# Altium schematic sheet 上层控制板.SchDoc
size A3; SheetNumber: 1; SheetTotal: 3
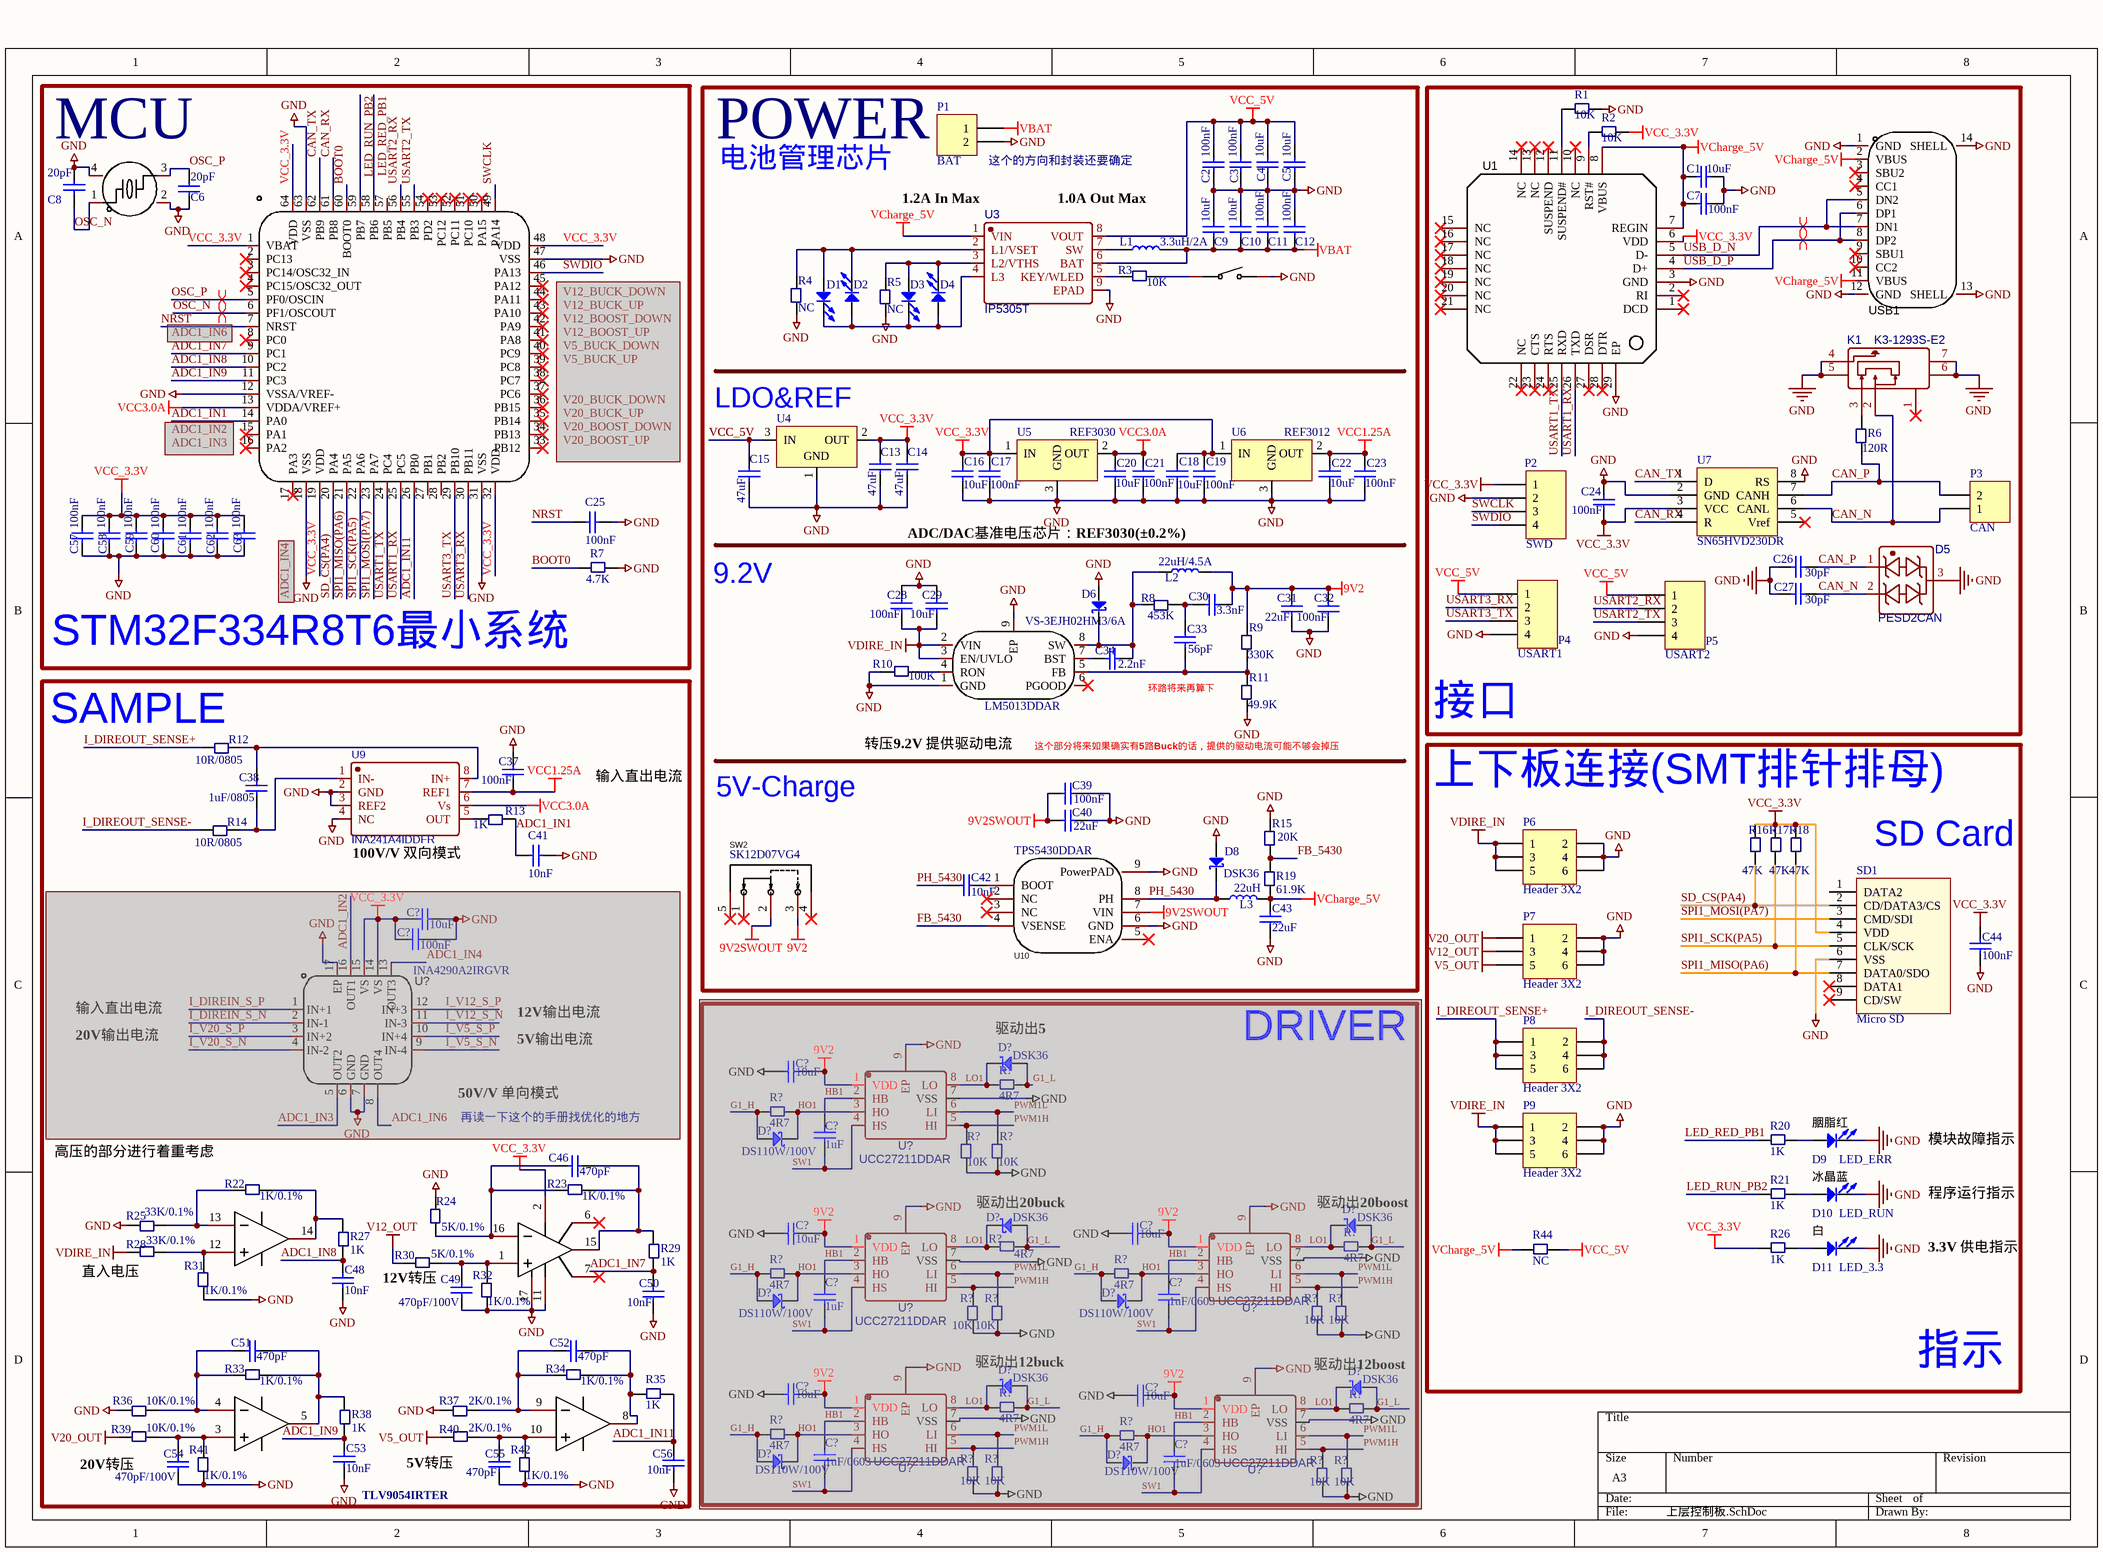
[diagram p0: 上层控制板.SchDoc]

## Parts
(Parts that share a designator on the sheet are numbered #1, #2 ... from top to bottom, then left to right.)
C1  10uF  [C 0603_M]
C2  100nF  [C 0603_M]
C3  100nF  [C 0603_M]
C4  10uF  [C 0603_M]
C5  10uF  [C 0603_M]
C6  20pF  [C 0603_M]
C7  100nF  [C 0603_M]
C8  20pF  [C 0603_M]
C9  10uF  [C 0603_M]
C10  10uF  [C 0603_M]
C11  100nF  [C 0603_M]
C12  100nF  [C 0603_M]
C13  47uF  [CAP-SMD_L3.2-W1.6]
C14  47uF  [CAP-SMD_L3.2-W1.6]
C15  47uF  [CAP-SMD_L3.2-W1.6]
C16  10uF  [C 0603_M]
C17  100nF  [C 0603_M]
C18  10uF  [C 0603_M]
C19  100nF  [C 0603_M]
C20  10uF  [C 0603_M]
C21  100nF  [C 0603_M]
C22  10uF  [C 0603_M]
C23  100nF  [C 0603_M]
C24  100nF  [C 0603_M]
C25  100nF  [C 0603_M]
C26  30pF  [C 0603_M]
C27  30pF  [C 0603_M]
C28  100nF  [C 0805]
C29  10uF  [C 0805]
C30  3.3nF  [C 0805]
C31  22uF  [C 0603_M]
C32  100nF  [C 0603_M]
C33  56pF  [C 0805]
C34  2.2nF  [C 0603_M]
C37  100nF  [C 0603_M]
C38  1uF/0805  [C 0805]
C39  100nF  [C 0603_M]
C40  22uF  [C 0603_M]
C41  10nF  [C 0603_M]
C42  10nF  [C 0603_M]
C43  22uF  [C 0603_M]
C44  100nF  [C 0603_M]
C46  470pF  [C 0603_M]
C48  10nF  [C 0603_M]
C49  470pF/100V  [C 0603_M]
C50  10nF  [C 0603_M]
C51  470pF  [C 0603_M]
C52  470pF  [C 0603_M]
C53  10nF  [C 0603_M]
C54  470pF/100V  [C 0603_M]
C55  470pF  [C 0603_M]
C56  10nF  [C 0603_M]
C57  100nF  [C 0603_M]
C58  100nF  [C 0603_M]
C59  100nF  [C 0603_M]
C60  100nF  [C 0603_M]
C61  100nF  [C 0603_M]
C62  100nF  [C 0603_M]
C63  100nF  [C 0603_M]
C?#1  10uF  [C_0603]  (masked out: inside a compile mask, not in the netlist)
C?#2  100nF  [C_0603]  (masked out: inside a compile mask, not in the netlist)
C?#3  10uF  [C 0603_M]  (masked out: inside a compile mask, not in the netlist)
C?#4  1uF  [C 0603_M]  (masked out: inside a compile mask, not in the netlist)
C?#5  10uF  [C 0603_M]  (masked out: inside a compile mask, not in the netlist)
C?#6  10uF  [C 0603_M]  (masked out: inside a compile mask, not in the netlist)
C?#7  1uF  [C 0603_M]  (masked out: inside a compile mask, not in the netlist)
C?#8  1uF/0603  [C 0603_M]  (masked out: inside a compile mask, not in the netlist)
C?#9  10uF  [C 0603_M]  (masked out: inside a compile mask, not in the netlist)
C?#10  10uF  [C 0603_M]  (masked out: inside a compile mask, not in the netlist)
C?#11  1uF/0603  [C 0603_M]  (masked out: inside a compile mask, not in the netlist)
C?#12  1uF/0603  [C 0603_M]  (masked out: inside a compile mask, not in the netlist)
D1  LED  [LED-0603W]  (value not drawn)
D2  LED  [LED-0603W]  (value not drawn)
D3  LED  [LED-0603W]  (value not drawn)
D4  LED  [LED-0603W]  (value not drawn)
D5  PESD2CAN  [SOT-23-3_L2.9-W1.3-P1.90-LS2.4-BR]
D6  VS-3EJH02HM3/6A  [DO-221AC_L4.4-W2.6-LS5.2-RD]
D8  DSK36  [SOD-123FL_L2.8-W1.8-LS3.7-R-RD]
D9  LED_ERR  [LED-0603W]
D10  LED_RUN  [LED-0603W]
D11  LED_3.3  [LED-0603W]
D?#1  DSK36  [SOD-123FL_L2.7-W1.8-LS3.8-RD]  (masked out: inside a compile mask, not in the netlist)
D?#2  DS110W/100V  [SOD-123FL_L2.7-W1.8-LS3.8-RD]  (masked out: inside a compile mask, not in the netlist)
D?#3  DSK36  [SOD-123FL_L2.7-W1.8-LS3.8-RD]  (masked out: inside a compile mask, not in the netlist)
D?#4  DSK36  [SOD-123FL_L2.7-W1.8-LS3.8-RD]  (masked out: inside a compile mask, not in the netlist)
D?#5  DS110W/100V  [SOD-123FL_L2.7-W1.8-LS3.8-RD]  (masked out: inside a compile mask, not in the netlist)
D?#6  DS110W/100V  [SOD-123FL_L2.7-W1.8-LS3.8-RD]  (masked out: inside a compile mask, not in the netlist)
D?#7  DSK36  [SOD-123FL_L2.7-W1.8-LS3.8-RD]  (masked out: inside a compile mask, not in the netlist)
D?#8  DSK36  [SOD-123FL_L2.7-W1.8-LS3.8-RD]  (masked out: inside a compile mask, not in the netlist)
D?#9  DS110W/100V  [SOD-123FL_L2.7-W1.8-LS3.8-RD]  (masked out: inside a compile mask, not in the netlist)
D?#10  DS110W/100V  [SOD-123FL_L2.7-W1.8-LS3.8-RD]  (masked out: inside a compile mask, not in the netlist)
K1  K3-1293S-E2  [K3-1293S-E2]
L1  3.3uH/2A  [IND-SMD_L5.4-W5.2_FXL0530]
L2  22uH/4.5A  [IND-SMD_L7.1-W6.6]
L3  22uH  [IND-SMD_L7.2-W6.6_GPSR07X0]
P1  BAT  [BM02B-GHS-TBT]
P2  SWD  [BM04B-GHS-TBT]
P3  CAN  [BM02B-GHS-TBT]
P4  USART1  [BM04B-GHS-TBT]
P5  USART2  [BM04B-GHS-TBT]
P6  Header 3X2  [HDR-SMD_6P-P2.54-V-F-R2-C3-LS7.0]
P7  Header 3X2  [HDR-SMD_6P-P2.54-V-F-R2-C3-LS7.0]
P8  Header 3X2  [HDR-SMD_6P-P2.54-V-F-R2-C3-LS7.0]
P9  Header 3X2  [HDR-SMD_6P-P2.54-V-F-R2-C3-LS7.0]
R1  10K  [R0603_M]
R2  10K  [R0603_M]
R3  10K  [R0603_M]
R4  NC  [R0603_M]
R5  NC  [R0603_M]
R6  120R  [R0603_M]
R7  4.7K  [R0603_M]
R8  453K  [R0805]
R9  330K  [R0603_M]
R10  100K  [R0603_M]
R11  49.9K  [R0603_M]
R12  10R/0805  [R0805]
R13  1K  [R0603_M]
R14  10R/0805  [R0805]
R15  20K  [R0603_M]
R16  47K  [R0603_M]
R17  47K  [R0603_M]
R18  47K  [R0603_M]
R19  61.9K  [R0603_M]
R20  1K  [R0603_M]
R21  1K  [R0603_M]
R22  1K/0.1%  [R0805]
R23  1K/0.1%  [R0603_M]
R24  5K/0.1%  [R0603_M]
R25  33K/0.1%  [R0805]
R26  1K  [R0603_M]
R27  1K  [R0603_M]
R28  33K/0.1%  [R0805]
R29  1K  [R0603_M]
R30  5K/0.1%  [R0603_M]
R31  1K/0.1%  [R0805]
R32  1K/0.1%  [R0603_M]
R33  1K/0.1%  [R0603_M]
R34  1K/0.1%  [R0603_M]
R35  1K  [R0603_M]
R36  10K/0.1%  [R0603_M]
R37  2K/0.1%  [R0603_M]
R38  1K  [R0603_M]
R39  10K/0.1%  [R0603_M]
R40  2K/0.1%  [R0603_M]
R41  1K/0.1%  [R0603_M]
R42  1K/0.1%  [R0603_M]
R44  NC  [R1206_M]
R?#1  4R7  [R0603]  (masked out: inside a compile mask, not in the netlist)
R?#2  4R7  [R0603]  (masked out: inside a compile mask, not in the netlist)
R?#3  10K  [R0402]  (masked out: inside a compile mask, not in the netlist)
R?#4  10K  [R0402]  (masked out: inside a compile mask, not in the netlist)
R?#5  4R7  [R0603]  (masked out: inside a compile mask, not in the netlist)
R?#6  4R7  [R0603]  (masked out: inside a compile mask, not in the netlist)
R?#7  4R7  [R0603]  (masked out: inside a compile mask, not in the netlist)
R?#8  4R7  [R0603]  (masked out: inside a compile mask, not in the netlist)
R?#9  10K  [R0402]  (masked out: inside a compile mask, not in the netlist)
R?#10  10K  [R0402]  (masked out: inside a compile mask, not in the netlist)
R?#11  10K  [R0402]  (masked out: inside a compile mask, not in the netlist)
R?#12  10K  [R0402]  (masked out: inside a compile mask, not in the netlist)
R?#13  4R7  [R0603]  (masked out: inside a compile mask, not in the netlist)
R?#14  4R7  [R0603]  (masked out: inside a compile mask, not in the netlist)
R?#15  4R7  [R0603]  (masked out: inside a compile mask, not in the netlist)
R?#16  4R7  [R0603]  (masked out: inside a compile mask, not in the netlist)
R?#17  10K  [R0402]  (masked out: inside a compile mask, not in the netlist)
R?#18  10K  [R0402]  (masked out: inside a compile mask, not in the netlist)
R?#19  10K  [R0402]  (masked out: inside a compile mask, not in the netlist)
R?#20  10K  [R0402]  (masked out: inside a compile mask, not in the netlist)
SD1  Micro SD  [MICRO SD]
SW1  TS365TP  [KEY-SMD_L6.0-W3.5-LS8.4]  (value not drawn)
SW2  SK12D07VG4  [SW-TH_SK12D07VG4]
U1  CP2102-GMR  [WQFN-28_L5.0-W5.0-P0.50-BL-EP3.2]  (value not drawn)
U2  STM32F334R8T6  [LQFP-64_L10.0-W10.0-P0.50-LS12.0-BL]  (value not drawn)
U3  IP5305T  [ESOP-8_L4.9-W3.9-P1.27-LS6.0-BL-EP]
U4  LM1117-3.3  [SOT_223]  (value not drawn)
U5  REF3030  [SOT_23]
U6  REF3012  [SOT_23]
U7  SN65HVD230DR  [SOIC-8_L4.9-W3.9-P1.27-LS6.0-BL]
U8  LM5013DDAR  [ESOP-8_L4.9-W3.9-P1.27-LS6.0-BL-EP-1]
U9  INA241A4IDDFR  [SOT-23-8_L2.9-W1.6-P0.65-LS2.8-BL]
U10  TPS5430DDAR  [ESOP-8_L4.9-W3.9-P1.27-LS6.0-TL-EP]
U11  TLV9054IRTER  [WQFN-16_L3.0-W3.0-P0.50-TL-EP1.7]  (value not drawn)  (parts A,B,C,D of 4)
U?#1  INA4290A2IRGVR  [QFN-16_L4.0-W4.0-P0.65-TL-EP2.2]  (masked out: inside a compile mask, not in the netlist)
U?#2  UCC27211DDAR  [SOIC-8_L4.9-W3.9-P1.27-LS6.0-BL-EP]  (masked out: inside a compile mask, not in the netlist)
U?#3  UCC27211DDAR  [SOIC-8_L4.9-W3.9-P1.27-LS6.0-BL-EP]  (masked out: inside a compile mask, not in the netlist)
U?#4  UCC27211DDAR  [SOIC-8_L4.9-W3.9-P1.27-LS6.0-BL-EP]  (masked out: inside a compile mask, not in the netlist)
U?#5  UCC27211DDAR  [SOIC-8_L4.9-W3.9-P1.27-LS6.0-BL-EP]  (masked out: inside a compile mask, not in the netlist)
U?#6  UCC27211DDAR  [SOIC-8_L4.9-W3.9-P1.27-LS6.0-BL-EP]  (masked out: inside a compile mask, not in the netlist)
USB1  TYPE-C 16PIN 2MD(073)  [USB-C-SMD_TYPE-C-6PIN-2MD-073]  (value not drawn)
X1  X32258MOB4SI  [OSC-SMD_4P-L3.2-W2.5-BL]  (value not drawn)

## Blocks framed on the sheet
MCU: C6 C8 C25 C57-C63 R7 U2 X1
POWER: C2-C5 C9-C23 C28-C34 C39 C40 C42 C43 D1-D4 D6 D8 L1-L3 P1 R3-R5 R8-R11 R15 R19 SW1 SW2 U3-U6 U8 U10
接口: C1 C7 C24 C26 C27 D5 K1 P2-P5 R1 R2 R6 U1 U7 USB1
SAMPLE: C37 C38 C41 C46 C48-C56 C?#1 C?#2 R12-R14 R22-R25 R27-R42 U9 U11 U?#1
DRIVER: C?#3-C?#12 D?#1-D?#10 R?#1-R?#20 U?#2-U?#6

## Nets
9V2: C30.1 C31.1 C32.1 L2.2 R9.1 SW2.3
9V2SWOUT: C39.1 C40.1 SW2.2 U10.7(VIN)
GND: C1.1 C2.1 C3.1 C4.1 C5.1 C6.2 C7.1 C8.1 C9.2 C10.2 C11.2 C12.2 C13.1 C14.1 C15.1 C16.1 C17.1 C18.1 C19.1 C20.1 C21.1 C22.1 C23.1 C24.2 C25.1 C26.2 C27.2 C28.1 C29.1 C31.2 C32.2 C37.2 C39.2 C40.2 C41.1 C43.2 C44.1 C48.2 C49.1 C50.2 C53.2 C54.1 C55.1 C56.2 C57.1 C58.1 C59.1 C60.1 C61.1 C62.1 C63.1 D5.3 D6.1(A) D8.1(A) D9.2(K) D10.2(K) D11.2(K) K1.4 K1.5 K1.6 K1.7 P1.1(2) P2.2 P4.4 P5.4 P6.2 P6.4 P6.6 P7.2 P7.4 P7.6 P9.2 P9.4 P9.6 R1.1 R4.2 R5.2 R7.1 R10.2 R11.2 R15.1 R24.1 R25.1 R31.2 R32.2 R36.1 R37.1 R41.2 R42.2 SD1.6(VSS) SW1.2 U1.3(GND) U1.29(EP) U2.12(VSSA/VREF-) U2.18(VSS) U2.31(VSS) U2.47(VSS) U2.63(VSS) U3.9(EPAD) U4.1(GND) U5.3(GND) U6.3(GND) U7.2(GND) U7.8(RS) U8.1(GND) U8.9(EP) U9.2(GND) U9.3(REF2) U9.4(NC) U10.6(GND) U10.9(PowerPAD) U11.11(V-) U11.17(EP) USB1.1(GND) USB1.12(GND) USB1.13(SHELL) USB1.14(SHELL) X1.2(GND) X1.4(GND)
V5_OUT: P7.5 R40.2
V12_OUT: P7.3 R30.2
V20_OUT: P7.1 R39.2
VBAT: C9.1 C10.1 C11.1 C12.1 L1.2 P1.2(1) U3.6(BAT)
VCC1.25A: C22.2 C23.2 C37.1 U6.2(OUT) U9.7(REF1)
VCC3.0A: C20.2 C21.2 U2.13(VDDA/VREF+) U5.2(OUT) U9.6(Vs)
VCC_3.3V: C13.2 C14.2 C16.2 C17.2 C18.2 C19.2 C24.1 C44.2 C57.2 C58.2 C59.2 C60.2 C61.2 C62.2 C63.2 P2.1 R2.1 R16.2 R17.2 R18.2 R26.2 SD1.4(VDD) U1.6(VDD) U2.1(VBAT) U2.19(VDD) U2.32(VDD) U2.48(VDD) U2.64(VDD) U4.2(OUT) U5.1(IN) U6.1(IN) U7.3(VCC) U11.2(V+)
VCC_5V: C2.2 C3.2 C4.2 C5.2 C15.2 P4.1 P5.1 R44.1 U3.8(VOUT) U4.3(IN)
VCharge_5V: C1.2 C7.2 C43.1 L3.2 R19.2 R44.2 U1.7(REGIN) U1.8(VBUS) U3.1(VIN) USB1.2(VBUS) USB1.11(VBUS)
VDIRE_IN: C28.2 C29.2 P6.1 P6.3 P6.5 P9.1 P9.3 P9.5 R28.2 U8.2(VIN) U8.3(EN/UVLO)
ADC1_IN1: C41.2 R13.2 U2.14(PA0)
ADC1_IN7: C50.1 R29.1 U2.9(PC1)
ADC1_IN8: C48.1 R27.1 U2.10(PC2)
ADC1_IN9: C53.1 R38.1 U2.11(PC3)
ADC1_IN11: C56.1 R35.1 U2.26(PB0)
BOOT0: R7.2 U2.60(BOOT0)
CAN_N: C27.1 D5.2 K1.2 P3.2(1) U7.6(CANL)
CAN_P: C26.1 D5.1 P3.1(2) R6.2 U7.7(CANH)
CAN_RX: U2.61(PB8) U7.4(R)
CAN_TX: U2.62(PB9) U7.1(D)
FB_5430: R15.2 R19.1 U10.4(VSENSE)
I_DIREOUT_SENSE+: P8.1 P8.3 P8.5 R12.1
I_DIREOUT_SENSE-: P8.2 P8.4 P8.6 R14.1
LED_RED_PB1: R20.2 U2.58(PB6)
LED_RUN_PB2: R21.2 U2.59(PB7)
NRST: C25.2 U2.7(NRST)
OSC_N: C8.2 U2.6(PF1/OSCOUT) X1.1
OSC_P: C6.1 U2.5(PF0/OSCIN) X1.3
PH_5430: C42.2 D8.2(K) L3.1 U10.8(PH)
SD_CS(PA4): R16.1 SD1.2(CD/DATA3/CS) U2.20(PA4)
SPI1_MISO(PA6): R18.1 SD1.7(DATA0/SDO) U2.21(PA5)
SPI1_MOSI(PA7): SD1.3(CMD/SDI) U2.23(PA7)
SPI1_SCK(PA5): R17.1 SD1.5(CLK/SCK) U2.22(PA6)
SWCLK: P2.3 U2.49(PA14)
SWDIO: P2.4 U2.46(PA13)
USART1_RX: U1.26(TXD) U2.25(PC5)
USART1_TX: U1.25(RXD) U2.24(PC4)
USART2_RX: P5.2 U2.56(PB4)
USART2_TX: P5.3 U2.55(PB3)
USART3_RX: P4.2 U2.30(PB11)
USART3_TX: P4.3 U2.29(PB10)
USB_D_N: U1.5(D-) USB1.5(DN2) USB1.7(DN1)
USB_D_P: U1.4(D+) USB1.6(DP1) USB1.8(DP2)
NetC30_2: C30.2 C33.1 R8.2
NetC33_2: C33.2 R9.2 R11.1 U8.5(FB)
NetC34_1: C34.1 D6.2(K) L2.1 R8.1 U8.8(SW)
NetC34_2: C34.2 U8.7(BST)
NetC38_1: C38.1 R14.2 U9.1(IN-)
NetC38_2: C38.2 R12.2 U9.8(IN+)
NetC42_1: C42.1 U10.1(BOOT)
NetC46_1: C46.1 R23.2 R24.2 U11.16(IN1-)
NetC46_2: C46.2 R23.1 R29.2 U11.15(OUT1)
NetC49_2: C49.2 R30.1 R32.1 U11.1(IN1+)
NetC51_1: C51.1 R33.2 R36.2 U11.4(IN2-)
NetC51_2: C51.2 R33.1 R38.2 U11.5(OUT2)
NetC52_1: C52.1 R34.2 R37.2 U11.9(IN3-)
NetC52_2: C52.2 R34.1 R35.2 U11.8(OUT3)
NetC54_2: C54.2 R39.1 R41.1 U11.3(IN2+)
NetC55_2: C55.2 R40.1 R42.1 U11.10(IN3+)
NetD1_1: D1.1(A) D2.2(K) R4.1 U3.2(L1/VSET)
NetD1_2: D1.2(K) D2.1(A) D3.2(K) D4.1(A) U3.4(L3)
NetD3_1: D3.1(A) D4.2(K) R5.1 U3.3(L2/VTHS)
NetD9_1: D9.1(A) R20.1
NetD10_1: D10.1(A) R21.1
NetD11_1: D11.1(A) R26.1
NetK1_3: K1.3 R6.1
NetL1_1: L1.1 U3.7(SW)
NetR1_2: R1.2 U1.11(SUSPEND#)
NetR2_2: R2.2 U1.9(RST#)
NetR3_1: R3.1 SW1.1
NetR3_2: R3.2 U3.5(KEY/WLED)
NetR10_1: R10.1 U8.4(RON)
NetR13_1: R13.1 U9.5(OUT)
NetR22_1: R22.1 R27.2 U11.14(OUT4)
NetR22_2: R22.2 R25.2 U11.13(IN4-)
NetR28_1: R28.1 R31.1 U11.12(IN4+)

Not connected (* = marked no-connect by the designer): K1 1*; SD1 1(DATA2) 8(DATA1)* 9(CD/SW)*; SW2 1* 4* 5*; U1 1(DCD)* 2(RI)* 10(NC)* 12(SUSPEND)* 13(NC)* 14(NC)* 15(NC)* 16(NC)* 17(NC)* 18(NC)* 19(NC)* 20(NC)* 21(NC)* 22(NC)* 23(CTS)* 24(RTS)* 27(DSR)* 28(DTR)*; U2 2(PC13)* 3(PC14/OSC32_IN)* 4(PC15/OSC32_OUT)* 8(PC0)* 15(PA1)* 16(PA2)* 17(PA3)* 27(PB1) 28(PB2) 33(PB12)* 34(PB13)* 35(PB14)* 36(PB15)* 37(PC6)* 38(PC7)* 39(PC8)* 40(PC9)* 41(PA8)* 42(PA9)* 43(PA10)* 44(PA11)* 45(PA12)* 50(PA15)* 51(PC10)* 52(PC11)* 53(PC12)* 54(PD2)* 57(PB5); U7 5(Vref)*; U8 6(PGOOD)*; U10 2(NC)* 3(NC)* 5(ENA)*; U11 6(NC)* 7(NC)*; USB1 3(SBU2)* 4(CC1)* 9(SBU1)* 10(CC2)*

## Layout directives
differential pair: OSC_N, OSC_P, USB_D_N, USB_D_P

## Notes on the sheet
- 电池管理芯片
- (near U3) 1.2A In Max
- (near P1) 这个的方向和封装还要确定
- 1.0A Out Max
- (near U4) LDO&REF
- ADC/DAC基准电压芯片：REF3030(±0.2%)
- 9.2V
- STM32F334R8T6最小系统
- 环路将来再算下
- 转压9.2V 提供驱动电流
- 这个部分将来如果确实有5路Buck的话，提供的驱动电流可能不够会掉压
- 输入直出电流
- 5V-Charge
- 上下板连接(SMT排针排母)
- (near U9) 100V/V 双向模式
- (near SD1) SD Card
- 12V输出电流
- (near D?#1) 驱动出5
- 20V输出电流
- (near U?#1) 50V/V 单向模式
- 5V输出电流
- 高压的部分进行着重考虑
- 再读一下这个的手册找优化的地方
- (near D9) 胭脂红
- 模块故障指示
- (near D?#3) 驱动出20buck
- (near D?#4) 驱动出20boost
- (near D11) 白
- (near D10) 冰晶蓝
- 程序运行指示
- 直入电压
- (near R30) 12V转压
- 3.3V 供电指示
- (near D?#7) 驱动出12buck
- (near D?#8) 驱动出12boost
- 指示
- (near R39) 20V转压
- (near R40) 5V转压

## Library data of the parts
C1-C34 C37 C39-C44 C46 C48-C63 C?#1-C?#12 = Cap: Capacitor; Published: 8-Jun-2000; LatestRevisionDate: 17-Jul-2002; LatestRevisionNote: Re-released for DXP Platform.; PackageReference: RAD-0.3; Publisher: Altium Limited; PackageDescription: Radial Cap, Thru-Hole; 2 Leads; 0.3 in Pin Spacing
C38 = Cap: Capacitor 0805 100V; Published: 8-Jun-2000; LatestRevisionDate: 17-Jul-2002; LatestRevisionNote: Re-released for DXP Platform.; PackageReference: RAD-0.3; Publisher: Altium Limited; PackageDescription: Radial Cap, Thru-Hole; 2 Leads; 0.3 in Pin Spacing
D1-D4 D9-D11 = LED: Typical INFRARED GaAs LED; Published: 8-Jun-2000; LatestRevisionDate: 08-Jul-2005; LatestRevisionNote: Mech Layer 1 removed.; PackageReference: LED-0; Publisher: Altium Limited; PackageDescription: LED; 2 Leads
D5 = PESD2CAN_C907830: BOM_Manufacturer: TECH PUBLIC; Contributor: LCSC; BOM_Supplier: LCSC; BOM_Supplier Part: C907830; BOM_Manufacturer Part: PESD2CAN; BOM_JLCPCB Part Class: Extended Part; spicePre: D; spiceSymbolName: PESD2CAN_C907830
D6 = D Schottky: 200V/3A / 超快恢复二极管 / C506616; Published: 8-Jun-2000; LatestRevisionDate: 17-Jul-2002; LatestRevisionNote: Re-released for DXP Platform.; PackageReference: SMB; Publisher: Altium Limited; PackageDescription: DO-214-AA/SMB; 2 C-Bend Leads; Body 5.3 x 3.6 mm, inc. leads (LxW); Code_JEDEC: DO-214-AA
D8 D?#1-D?#10 = D Schottky: Schottky Diode; Published: 8-Jun-2000; LatestRevisionDate: 17-Jul-2002; LatestRevisionNote: Re-released for DXP Platform.; PackageReference: SMB; Publisher: Altium Limited; PackageDescription: DO-214-AA/SMB; 2 C-Bend Leads; Body 5.3 x 3.6 mm, inc. leads (LxW); Code_JEDEC: DO-214-AA
K1 = MSK12C02: BOM_Manufacturer: SHOU HAN; Contributor: LCSC; BOM_Supplier: LCSC; BOM_Supplier Part: C431540; BOM_Manufacturer Part: MSK12C02; BOM_JLCPCB Part Class: Extended Part; spicePre: S; spiceSymbolName: MSK12C02
L1-L3 = Inductor: Code_IEC: 1005; Published: 8-Jun-2000; LatestRevisionDate: 17-Jul-2002; LatestRevisionNote: Re-released for DXP Platform.; PackageReference: 0402-A; Publisher: Altium Limited; Code_JEITA: 0402
P1 P3 = Header 2: SM02B-GHS-TB; LatestRevisionDate: 17-Jul-2002; LatestRevisionNote: Re-released for DXP Platform.; Publisher: Altium Limited
P2 P4 P5 = Header 4: SM04B-GHS-TB; LatestRevisionDate: 17-Jul-2002; LatestRevisionNote: Re-released for DXP Platform.; Publisher: Altium Limited
P6-P9 = Header 3X2: Header, 3-Pin, Dual row; LatestRevisionDate: 17-Jul-2002; LatestRevisionNote: Re-released for DXP Platform.; Publisher: Altium Limited
R1-R5 R16-R18 = Res2: Resistor; Published: 8-Jun-2000; LatestRevisionDate: 17-Jul-2002; LatestRevisionNote: Re-released for DXP Platform.; PackageReference: AXIAL-0.4; Publisher: Altium Limited
R6-R11 R15 R19-R42 R44 R?#1-R?#20 = Res: Resistor; Published: 8-Jun-2000; LatestRevisionDate: 17-Jul-2002; LatestRevisionNote: Re-released for DXP Platform.; PackageReference: AXIAL-0.4; Publisher: Altium Limited
R12-R14 = Res: Resistor 0805 100V; Published: 8-Jun-2000; LatestRevisionDate: 17-Jul-2002; LatestRevisionNote: Re-released for DXP Platform.; PackageReference: AXIAL-0.4; Publisher: Altium Limited
SD1 = Micro SD: Micro SD卡; 版权归属: 源创客; BOM名称: Micro SD卡; 学习资源: www.ooocke.com
SW1 = SW TS365TP: Manufacturer: SHOU HAN(首韩); Add into BOM: yes; Contact Current: 50mA; Voltage Rating (DC): 12V; Insulation Resistance: 100MΩ; Circuit: 单刀单掷; Actuator Style: 矩形按钮; Actuator/Cap Color: 白色; Mechanical Life: 5万次; Pin Style: 鸥翼型; Switch Length: 6mm; Switch Width: 3.5mm; Switch Height: 5mm; Strike Gundam: 否; Name: TS365TP; Symbol: TS365TP; Device: TS365TP; LCSC Part Name: 6*3.5*5mm 立贴 轻触开关; Supplier Part: C557595; Manufacturer Part: TS365TP; Supplier Footprint: SMD; JLCPCB Part Class: Extended Part; Datasheet: https://atta.szlcsc.com/upload/public/pdf/source/20200519/C557595_BB1634D66D9A126E1EE8D55D38E8F7FD.pdf; Supplier: LCSC; Convert to PCB: yes; Mounting Style: 立贴; Operating Temperature: -20℃~+70℃
SW2 = SW SK12D07VG4: Manufacturer: SHOU HAN(首韩); Add into BOM: yes; Operating Force: 130~330gf; Rated Voltage(DC): 50V; Contact Rating @ Voltage: 500mA @ 50VDC; Circuit: SPDT; Electrical Life Cycles: 5000; Switch Function: On-On; Switch Height: 4mm; Actuator Orientation: Horizontal; Contact Timing: Shorting (MBB); Actuator Type: Standard; Name: SK12D07VG4; Symbol: SK12D07VG4; Device: SK12D07VG4; LCSC Part Name: 3脚2二档位SK12D07VG4滑动开关1P2T卧式拨动开关; Supplier Part: C393937; Manufacturer Part: SK12D07VG4; Supplier Footprint: 插件,P=2mm; JLCPCB Part Class: Extended Part; Supplier: LCSC; Convert to PCB: yes; Contact Material: Brass; Contact Finish: -; Operating Temperature: -; Rated Voltage(AC): -; Mounting Type: Through Hole, Right Angle; Termination Style: PC 引脚
U1 = U_CP2102-GMR: Manufacturer: SILICON LABS(芯科); Add into BOM: yes; Applications Function: 收发器; Protocol: USB; Data Rate: 1Mbps; Supply Voltage: 3V~3.6V; Name: CP2102-GMR; Symbol: CP2102-GMR; Device: CP2102-GMR; LCSC Part Name: CP2102-GMR; Supplier Part: C6568; Manufacturer Part: CP2102-GMR; Supplier Footprint: WQFN-28-EP(5x5); JLCPCB Part Class: Basic Part; Datasheet: https://atta.szlcsc.com/upload/public/pdf/source/20170103/1483439882795.pdf; Supplier: LCSC; Convert to PCB: yes
U2 = U STM32F334R8T6: Manufacturer: ST(意法半导体); Add into BOM: yes; CPU Core: ARM Cortex-M4; Maximum Frequency: 72MHz; Supply Voltage Range: 2V~3.6V; Internal Oscillator: 有; Program FLASH Size: 64K@x8bit; RAM Size: 12KB; GPIO Ports Number: 51; ADC (Units/Channels/bits): 1@x21ch/12bit; DAC (Units/Channels/bits): 1@x3ch/12bit; Peripherals / Functions / Protocol Stacks: DMA；看门狗；POR；PWM; Name: STM32F334R8T6; Symbol: STM32F334R8T6; Device: STM32F334R8T6; LCSC Part Name: ARM Cortex-M4 72MHz 闪存：64K@x8bit RAM：12KB; Supplier Part: C80577; Manufacturer Part: STM32F334R8T6; Supplier Footprint: LQFP-64(10x10); JLCPCB Part Class: Extended Part; Datasheet: https://atta.szlcsc.com/upload/public/pdf/source/20170712/C80577_1499832474154814708.pdf; Supplier: LCSC; Convert to PCB: yes; EEPROM/Data FLASH Size: -; Operating Temperature Range: -40℃~+85℃
U3 = U IP5305T: BOM_Manufacturer: INJOINIC; BOM_Manufacturer Part: IP5305_4.35V; Contributor: LCSC; BOM_Supplier: LCSC; BOM_Supplier Part: C180942; BOM_JLCPCB Part Class: Extended Part; spicePre: U; spiceSymbolName: IP5305_4.35V
U4 = LM1117-3.3: 800mA Low-Dropout Linear Regulator, 3-pin TO-220; PartNumber: LM1117T-3.3; Manufacturer: National Semiconductor; PackageTopMarking: NSUZXYTTE#*LM1117T*3.3; PowerWise: N; CompType: LDO IC; Published: 4-Dec-2008; DatasheetVersion: Apr-2006; PackageVersion: revL, Jan-1992; PackageReference: T03B; Publisher: Altium Limited; PackageDescription: TO-220, Molded, 3 Lead, Straight; Supplier 1: Farnell; Supplier Part Number 1: 9485813; RoHS: N; PinCount: 3; ComponentLink1Description: LM1117 Datasheet; ComponentLink1URL: http://www.national.com/ds/LM/LM1117.pdf; ComponentLink2Description: LM1117 Web Page; ComponentLink2URL: http://www.national.com/pf/LM/LM1117.html; ComponentLink3Description: T03B Package Page; ComponentLink3URL: http://www.national.com/packaging/folders/t03b.html
U5 U6 = Component_1
U7 = SN65HVD230
U8 = U LM5013DDAR: Manufacturer: TI(德州仪器); Add into BOM: yes; Function: 降压型; Synchronous Rectification: 否; Output Type: 可调; Number of Outputs: 1; Topology: 降压式; Input Voltage: 6V~100V; Output Voltage: 1.2V~100V; Output Current (Max): 3.5A; Switching Frequency: 1MHz; Name: LM5013DDAR; Symbol: LM5013DDAR; Device: LM5013DDAR; LCSC Part Name: LM5013DDAR; Supplier Part: C5383001; Manufacturer Part: LM5013DDAR; Supplier Footprint: PowerSOIC-8; JLCPCB Part Class: Extended Part; Datasheet: https://atta.szlcsc.com/upload/public/pdf/source/20230922/205702B523703FC312096987301AC8D1.pdf; Supplier: LCSC; Convert to PCB: yes; Operating Temperature: -40℃~+150℃@(TJ)
U9 = U INA241A4IDDFR: 100倍增益; BOM_Manufacturer: TI; BOM_Manufacturer Part: INA240A1PWR; Contributor: LCSC; SMT Type: Extend; BOM_Supplier: LCSC; BOM_Supplier Part: C93965; BOM_LCSC Assembly: Yes; spicePre: U; spiceSymbolName: INA240A1PWR
U10 = U TPS5430DDAR: Manufacturer: TI(德州仪器); Add into BOM: yes; Function: 降压型; Name: TPS5430DDAR; Symbol: TPS5430DDAR; Device: TPS5430DDAR; LCSC Part Name: 降压型; Supplier Part: C9864; Manufacturer Part: TPS5430DDAR; Supplier Footprint: SO-8; JLCPCB Part Class: Basic Part; Datasheet: https://atta.szlcsc.com/upload/public/pdf/source/20161207/1481104217724.pdf; Supplier: LCSC; Convert to PCB: yes; Synchronous Rectification: -; Number of Outputs: -; Topology: -; Input Voltage: -; Output Current (Max): -; Switching Frequency: -
U11 = U TLV9054IRTER: Manufacturer: TI(德州仪器); Add into BOM: yes; Name: TLV9054IRTER; Symbol: TLV9054IRTER; Device: TLV9054IRTER; LCSC Part Name: TLV9054IRTER; Supplier Part: C2057810; Manufacturer Part: TLV9054IRTER; Supplier Footprint: WQFN-16(3x3); JLCPCB Part Class: Extended Part; Supplier: LCSC; Convert to PCB: yes
U?#1 = U INA4290A2IRGVR: Manufacturer: TI(德州仪器); Name: INA3221AIRGVR; Add into BOM: yes; Symbol: INA3221AIRGVR; Device: INA3221AIRGVR; LCSC Part Name: INA3221AIRGVR; Supplier Part: C181255; Manufacturer Part: INA3221AIRGVR; Supplier Footprint: QFN-16-EP(4x4); JLCPCB Part Class: Extended Part; Datasheet: https://atta.szlcsc.com/upload/public/pdf/source/20180227/C181255_15196973572891369901.pdf; Supplier: LCSC; Convert to PCB: yes
U?#2-U?#6 = UCC27211DDAR: BOM_Manufacturer: Texas Instruments; Contributor: LCSC; BOM_Supplier: LCSC; BOM_Supplier Part: C141980; BOM_Manufacturer Part: UCC27211DDAR; spicePre: U; spiceSymbolName: UCC27211DDAR
USB1 = P_TYPE-C 16PIN 2MD(073): C2765186 Type-C 母座 卧贴 带定位柱 不锈钢外壳 2次模顶; Manufacturer: SHOU HAN(首韩); Add into BOM: yes; Number of Contacts: 16; Number of Ports: 1; Current Rating - Power (Max): 5A; Name: TYPE-C 16PIN 2MD(073); Symbol: TYPE-C 16PIN 2MD(073); Device: TYPE-C 16PIN 2MD(073); LCSC Part Name: TYPE-C母座 16P 4脚插件带定位柱 不锈钢外壳 2次模顶; Supplier Part: C2765186; Manufacturer Part: TYPE-C 16PIN 2MD(073); Supplier Footprint: SMD; JLCPCB Part Class: Extended Part; Supplier: LCSC; Convert to PCB: yes; Connector Type: Type-C; Standard: -; Gender: 母座; Mounting Style: 卧贴; Operating Temperature Range: -25℃~+85℃
X1 = X32258MOB4SI: Manufacturer: YXC(扬兴晶振); Name: 8MHz; Add into BOM: yes; Crystal Type: 贴片无源晶振; Value: 8MHz; Frequency Tolerance: ±10ppm; Frequency Stability: ±30ppm; Load Capacitance: 12pF; Equivalent Series Resistance (ESR): 150Ω; Symbol: X32258MOB4SI; Device: X32258MOB4SI; LCSC Part Name: 8MHz ±10ppm 12pF YSX321SL; Supplier Part: C2682775; Manufacturer Part: X32258MOB4SI; Supplier Footprint: SMD3225-4P; JLCPCB Part Class: Extended Part; Datasheet: https://atta.szlcsc.com/upload/public/pdf/source/20210106/C2682774_0CD4FDA5D9DA3FBEEC23BD607A48E4B0.pdf; Supplier: LCSC; Convert to PCB: yes; Operating Temperature: -40℃~+85℃